# Altium schematic sheet Clk.SchDoc
size A
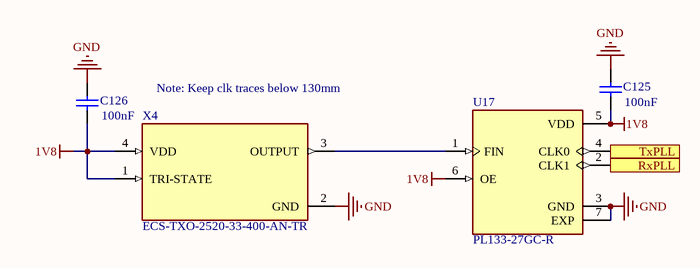
[diagram p0: Clk.SchDoc]

## Parts
C125  value 100nF  [0402-A]  (hidden comment: Cap)
C126  value 100nF  [0402-A]  (hidden comment: Cap)
U17  PL133-27GC-R  [SON40P130X200X60-7N]
X4  ECS-TXO-2520-33-400-AN-TR  [OSC_ECS-TXO-2520-33-400-AN-TR]

## Ports
RxPLL (out), TxPLL (out)

## Nets
1V8: C125.2 C126.2 U17.5(VDD) U17.6(OE) X4.1(TRI-STATE) X4.4(VDD)
GND: C125.1 C126.1 U17.3(GND) U17.7(EXP) X4.2(GND)
RxPLL: U17.2(CLK1) ; port RxPLL
TxPLL: U17.4(CLK0) ; port TxPLL
NetU17_1: U17.1(FIN) X4.3(OUTPUT)

## Notes on the sheet
- Note: Keep clk traces below 130mm

## Library data of the parts
C125 C126 = Cap: Capacitor; Published: 8-Jun-2000; LatestRevisionDate: 17-Jul-2002; LatestRevisionNote: Re-released for DXP Platform.; PackageReference: RAD-0.3; Publisher: Altium Limited; PackageDescription: Radial Cap, Thru-Hole; 2 Leads; 0.3 in Pin Spacing
U17 = PL133-27GC-R: Clock Fanout Buffer _Distribution_ IC 1:2 150MHz 6-UFDFN Exposed Pad; MF: Microchip; SnapEDA_Link: https://www.snapeda.com/parts/PL133-27GC-R/Microchip/view-part/524694/?ref=snap; Availability: Unavailable; MP: PL133-27GC-R; Price: None; Value: *; Package: UFDFN-6 Microchip
X4 = ECS-TXO-2520-33-400-AN-TR: 40MHz TCXO HCMOS Oscillator 3.3V Enable/Disable 4-SMD, No Lead; MF: ECS Inc.; Package: SMD-4 ECS International; Value: *; Availability: Unavailable; MP: ECS-TXO-2520-33-400-AN-TR; Price: None; SnapEDA_Link: https://www.snapeda.com/parts/ECS-TXO-2520-33-400-AN-TR/ECS%20Inc./view-part/699443/?ref=snap